# Altium project roverServoController.PrjPcb
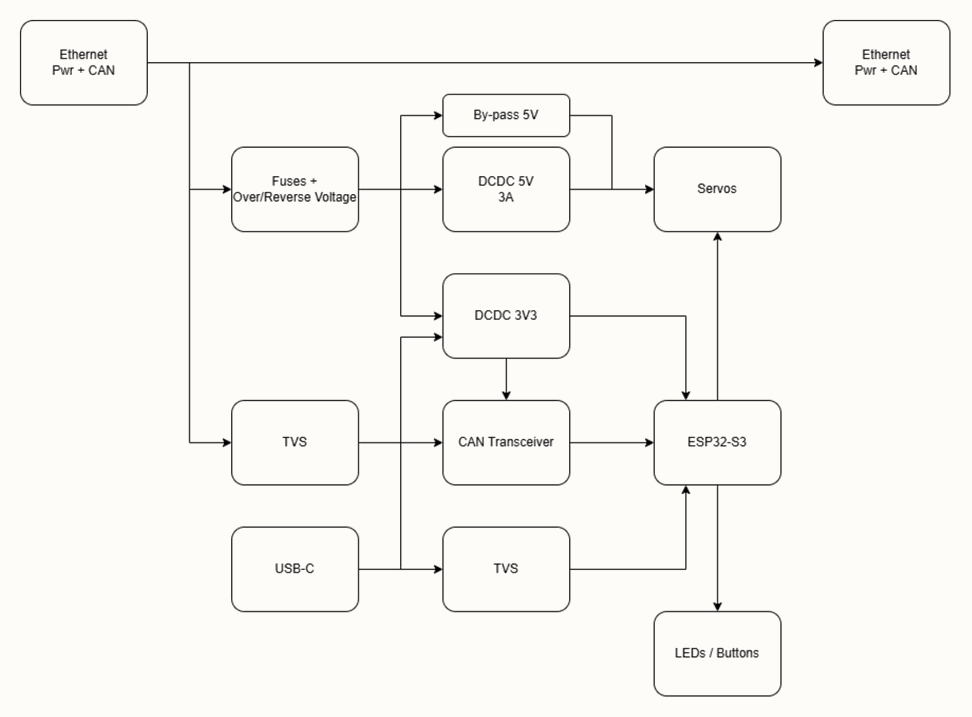
[diagram p0: Overview.SchDoc]
3 sheets, 72 parts. Net scope: flat (ports and power ports of the same name join across sheets).
Board file: roverServoController.PcbDoc
Sheets:
  Overview.SchDoc
  ESP32.SchDoc
  Power.SchDoc

## Sheet Overview.SchDoc
size A4; DrawnBy: Emile Renaud; Revision: V1.0; SheetNumber: 1; SheetTotal: 8

### Notes on the sheet
- Title:
- Date:
- Size:
- B
- Drawn by:
- Checked by:
- Sheet
- of
- Revision:
- File:

## Sheet ESP32.SchDoc
size A4; DrawnBy: Emile Renaud; Revision: V1.0; SheetNumber: 3; SheetTotal: 8
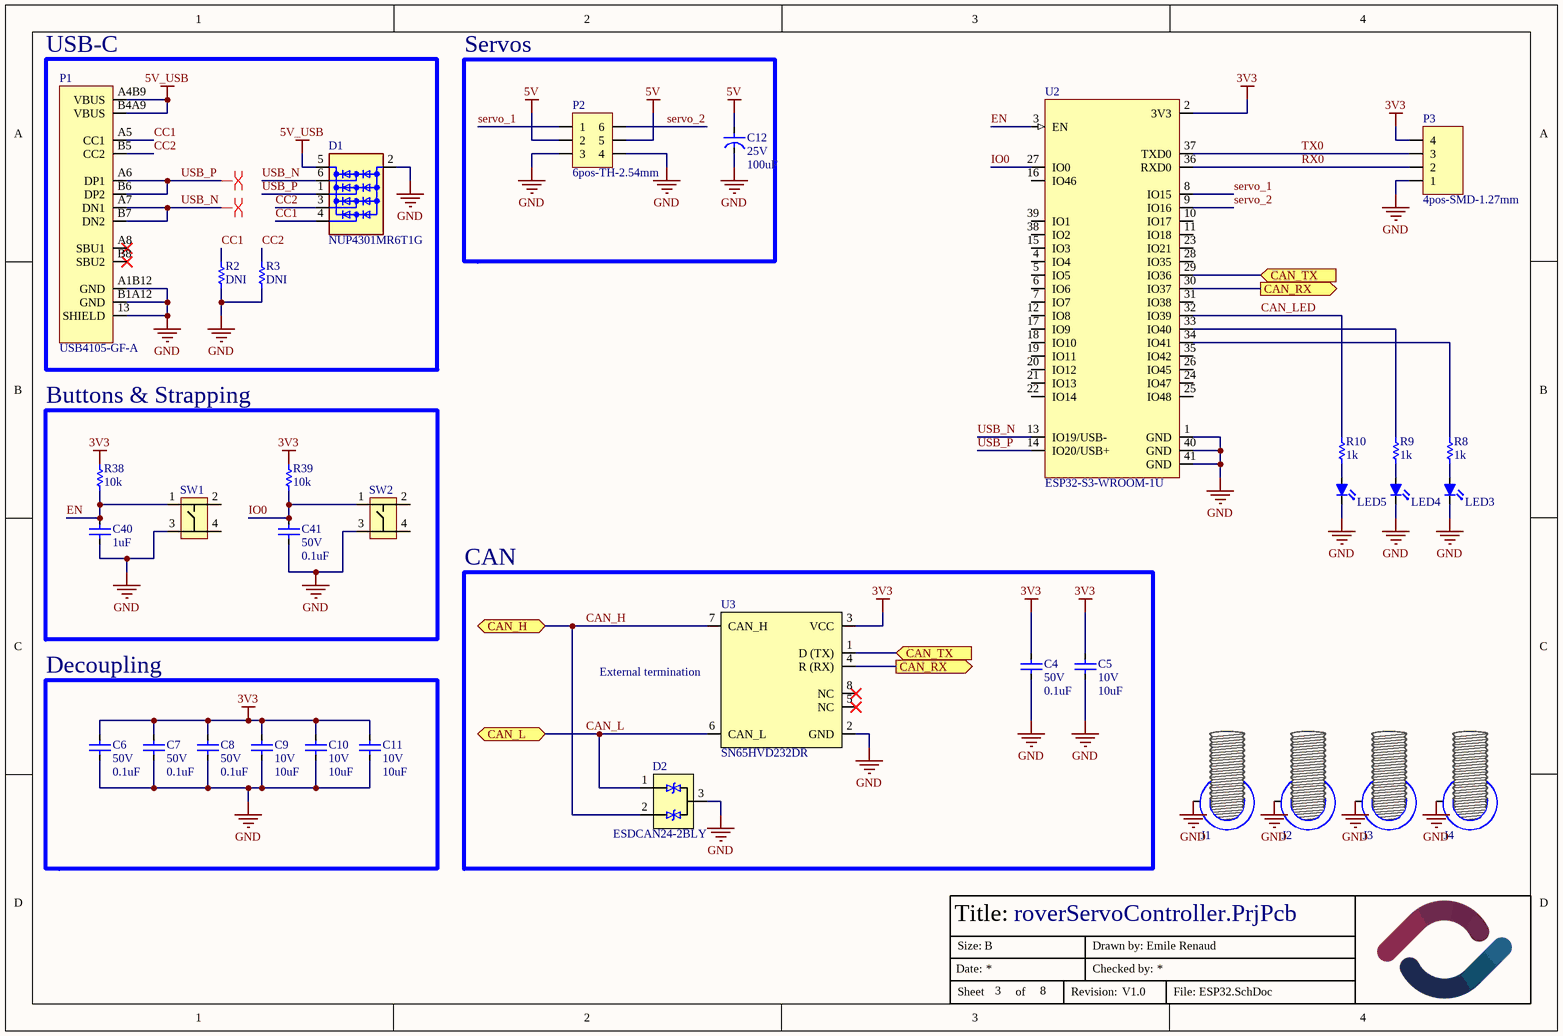
[diagram p1: ESP32.SchDoc]

### Parts
C4  value 0.1uF  Volt: 50V  [CAPACITOR-0603]  (hidden comment: Capacitor-0603-0.1uF-50V-X7R)
C5  value 10uF  Volt: 10V  [CAPACITOR-0603]  (hidden comment: Capacitor-0603-10uF-10V-X5R)
C6  value 0.1uF  Volt: 50V  [CAPACITOR-0603]  (hidden comment: Capacitor-0603-0.1uF-50V-X7R)
C7  value 0.1uF  Volt: 50V  [CAPACITOR-0603]  (hidden comment: Capacitor-0603-0.1uF-50V-X7R)
C8  value 0.1uF  Volt: 50V  [CAPACITOR-0603]  (hidden comment: Capacitor-0603-0.1uF-50V-X7R)
C9  value 10uF  Volt: 10V  [CAPACITOR-0603]  (hidden comment: Capacitor-0603-10uF-10V-X5R)
C10  value 10uF  Volt: 10V  [CAPACITOR-0603]  (hidden comment: Capacitor-0603-10uF-10V-X5R)
C11  value 10uF  Volt: 10V  [CAPACITOR-0603]  (hidden comment: Capacitor-0603-10uF-10V-X5R)
C12  value 100uF  Volt: 25V  [CAPACITOR-Aluminium-5x11mm-2mmPitch - SIDE]  (hidden comment: CAP ALUM 100UF 20% 25V RADIAL SIDE)
C40  value 1uF  [CAPACITOR-0603]  (hidden comment: Capacitor-0603-1uF-25V-X5R)
C41  value 0.1uF  Volt: 50V  [CAPACITOR-0603]  (hidden comment: Capacitor-0603-0.1uF-50V-X7R)
D1  NUP4301MR6T1G  [SOT-23-6]
D2  ESDCAN24-2BLY  [SOT-23-3]
J1  hole  [HOLE-3.40MM-M3-8MMEYELET]  (value not drawn)  (no BOM)
J2  hole  [HOLE-3.40MM-M3-8MMEYELET]  (value not drawn)  (no BOM)
J3  hole  [HOLE-3.40MM-M3-8MMEYELET]  (value not drawn)  (no BOM)
J4  hole  [HOLE-3.40MM-M3-8MMEYELET]  (value not drawn)  (no BOM)
LED3  3147-B1931NB--20C007614U1930CT-ND  [LED-0603-2PIN-SILKSCREEN]  (value not drawn)
LED4  3147-B1931NB--20C007614U1930CT-ND  [LED-0603-2PIN-SILKSCREEN]  (value not drawn)
LED5  3147-B1931NB--20C007614U1930CT-ND  [LED-0603-2PIN-SILKSCREEN]  (value not drawn)
P1  USB4105-GF-A  [USB-C]
P2  6pos-TH-2.54mm  [HDR2X3]
P3  4pos-SMD-1.27mm  [HDR1X4-SMD-50mils]
R2  value DNI  [RESISTOR-0603]  (hidden comment: Resistor-0603-5.1k)
R3  value DNI  [RESISTOR-0603]  (hidden comment: Resistor-0603-5.1k)
R8  value 1k  [Resistor-0603]  (hidden comment: SMT resistor)
R9  value 1k  [Resistor-0603]  (hidden comment: SMT resistor)
R10  value 1k  [Resistor-0603]  (hidden comment: SMT resistor)
R38  value 10k  [Resistor-0603]  (hidden comment: SMT resistor)
R39  value 10k  [Resistor-0603]  (hidden comment: SMT resistor)
SW1  PTS815 SJM 250 SMTR LFS  [SW4_PTS815 SJM 250 SMTR LFS_CNK]  (value not drawn)
SW2  PTS815 SJM 250 SMTR LFS  [SW4_PTS815 SJM 250 SMTR LFS_CNK]  (value not drawn)
U2  ESP32-S3-WROOM-1U  [ESP32-S3-WROOM-1U]
U3  SN65HVD232DR  [SOIC-8]

### Blocks framed on the sheet
USB-C: D1 P1 R2 R3
Servos: C12 P2
Buttons & Strapping: C40 C41 R38 R39 SW1 SW2
CAN: C4 C5 D2 U3
Decoupling: C6-C11

### Ports
CAN_H (bidir), CAN_L (bidir), CAN_RX (out), CAN_TX (in)

### Nets
3V3: C4.2 C5.2 C6.2 C7.2 C8.2 C9.2 C10.2 C11.2 P3.4 R38.2 R39.2 U2.2(3V3) U3.3(VCC)
5V: C12.1 P2.2 P2.5
5V_USB: D1.5(VDD) P1.A4B9(VBUS) P1.B4A9(VBUS)
GND: C4.1 C5.1 C6.1 C7.1 C8.1 C9.1 C10.1 C11.1 C12.2 C40.1 C41.1 D1.2(GND) D2.3(L3) J1.1 J2.1 J3.1 J4.1 LED3.1(K) LED4.1(K) LED5.1(K) P1.13(SHIELD) P1.A1B12(GND) P1.B1A12(GND) P2.3 P2.4 P3.1 R2.1 R3.1 SW1.3 SW2.3 U2.1(GND) U2.40(GND) U2.41(GND) U3.2(GND)
CAN_H: D2.2(GND) U3.7(CAN_H) ; port CAN_H
CAN_L: D2.1(L2) U3.6(CAN_L) ; port CAN_L
CAN_LED: R10.2 U2.32(IO39)
CAN_RX: U2.30(IO37) U3.4(R_(RX)) ; port CAN_RX
CAN_TX: U2.29(IO36) U3.1(D_(TX)) ; port CAN_TX
CC1: D1.4(L4) P1.A5(CC1) R2.2
CC2: D1.3(L3) P1.B5(CC2) R3.2
EN: C40.2 R38.1 SW1.1 U2.3(EN)
IO0: C41.2 R39.1 SW2.1 U2.27(IO0)
RX0: P3.2 U2.36(RXD0)
servo_1: P2.1 U2.8(IO15)
servo_2: P2.6 U2.9(IO16)
TX0: P3.3 U2.37(TXD0)
USB_N: D1.6(L1) P1.A7(DN1) P1.B7(DN2) U2.13(IO19/USB-)
USB_P: D1.1(L2) P1.A6(DP1) P1.B6(DP2) U2.14(IO20/USB+)
NetLED3_2: LED3.2(R) R8.1
NetLED4_2: LED4.2(R) R9.1
NetLED5_2: LED5.2(R) R10.1
NetR8_2: R8.2 U2.34(IO41)
NetR9_2: R9.2 U2.33(IO40)

Not connected (* = marked no-connect by the designer): P1 A8(SBU1)* B8(SBU2)*; SW1 2 4; SW2 2 4; U2 4(IO4) 5(IO5) 6(IO6) 7(IO7) 10(IO17) 11(IO18) 12(IO8) 15(IO3) 16(IO46) 17(IO9) 18(IO10) 19(IO11) 20(IO12) 21(IO13) 22(IO14) 23(IO21) 24(IO47) 25(IO48) 26(IO45) 28(IO35) 31(IO38) 35(IO42) 38(IO2) 39(IO1); U3 5(NC)* 8(NC)*

### Layout directives
differential pair; differential pair class USB: USB_N, USB_P

### Notes on the sheet
- (near U3) External termination
- Title:
- Date:
- Size:
- B
- Drawn by:
- Checked by:
- Sheet
- of
- Revision:
- File:

### Library data of the parts
C4 C6-C8 C41 = Capacitor-0603-0.1uF-50V-X7R: Precision: X7R-10%; Package / Case: Metric 1608, EIA 0603; Mounted: Yes; Supplier 1: Digi-Key; Supplier Part Number 1: 1276-1935-2-ND; Supplier 2: Digi-Key; Supplier Part Number 2: 1276-1934-2-ND
C5 C9-C11 = Capacitor-0603-10uF-10V-X5R: 10 µF ±20% 10V Ceramic Capacitor X5R 0603 (1608 Metric); Supplier 1: Digikey; Supplier Part Number 1: 4713-GMC10X5R106M10NTCT-ND; Mounted: Yes; Package / Case: Metric 1608 , EIA 0603; Precision: 20%
C12 = Capacitor-100uF-25V-Side: CAP ALUM 100UF 20% 25V RADIAL; Precision: 20%; Mounted: Yes; Supplier 1: Digi-Key; Supplier Part Number 1: 399-6102-ND; Supplier 2: Digi-Key
C40 = Capacitor-0603-1uF-25V-X5R: Precision: X5R-10%; Volt: 25V; Package / Case: Metric 1608, EIA 0603; Mounted: Yes; Supplier 1: Digi-Key; Supplier Part Number 1: 1276-1859-2-ND; Supplier 2: Digi-Key; Supplier Part Number 2: 1276-1942-2-ND
D1 = NUP4301MR6T1G: 4CH Clamp Ipp Tvs Diode Surface Mount SOT23-6 (SC74); Volt: 70; Supplier 1: Digi-Key; Supplier Part Number 1: NUP4301MR6T1GOSTR-ND; Mounted: Yes; Package / Case: SOT23-6
D2 = ESDCAN24-2BLY: 55V Clamp 6A (8/20µs) Ipp Tvs Diode Surface Mount SOT-23; Volt: 24; Supplier 1: Digi-Key; Supplier Part Number 1: 5272-ESDCAN24-2BLYCT-ND; Mounted: Yes; Package / Case: SOT-23-3
J1-J4 = Hole 3.40mm M3-Eyelet: Hole for M3 Bolt with 8mm pad; Mounted: N/A
LED3-LED5 = LED_BLUE: LED BLUE CLEAR 0603 SMD; Package / Case: 0603 (1608 Metric); Mounted: Yes; Supplier 1: Digi-Key; Supplier Part Number 1: 3147-B1931NB--20C007614U1930CT-ND
P1 = USB4105-GF-A: CONN RCP USB2.0 TYP C 24P SMD RA / 5A; Supplier 1: Digikey; Supplier Part Number 1: 2073-USB4105-GF-ACT-ND; Mounted: Yes; Package / Case: SMD; Volt: N/A
P2 = 6pos-TH-2.54mm 2x3: 6pos TH 2.54mm Header; Supplier 1: Digi-Key; Supplier Part Number 1: 952-2092-ND; Mounted: Yes; Package / Case: TH; Volt: N/A
P3 = 4pos-SMD-1.27mm: 4pos SMD 1.27mm; Supplier 1: Digi-Key; Supplier Part Number 1: N/A; Mounted: Yes; Package / Case: TH; Volt: N/A
R2 R3 = Resistor-0603-DNI: 0603 footprint DO NOT INSTALL; Mounted: Yes; Package/Case: Metric 1608 , EIA 0603
R8-R10 = Resistor-0603-1k: Resistor0603-1k; Precision: 1%; Watt: 0.1W; Mounted: Yes; Package / Case: Metric 1608, EIA 0603; Supplier 1: Digi-Key; Supplier Part Number 1: 311-1.00KHRCT-ND
R38 R39 = Resistor0603-10k: Precision: 1%; Watt: 0.1W; Mounted: Yes; Package / Case: Metric 1608, EIA 0603; Supplier 2: Digi-Key; Supplier 4: Digi-Key; Supplier Part Number 2: RMCF0603FT10K0TR-ND; Supplier 1: Digi-Key; Supplier 3: Digi-Key; Supplier Part Number 1: 311-10.0KHRTR-ND
SW1 SW2 = PTS815 SJM 250 SMTR LFS: TACT 4.2 X 3.2, 2.5 MM H, 180GF,; Volt: 12V; Current: 0.05A; Supplier 1: Digi-Key; Supplier Part Number 1: CKN12215-1-ND; Mounted: Yes
U2 = ESP32-S3-WROOM-1U: 2.4 GHz Wi-Fi (802.11 b/g/n) and Bluetooth 5 (LE) module; MF: Espressif Systems; Value: *; Package: Package; MP: ESP32-S3-WROOM-1U; Supplier 1: Digikey; Supplier Part Number 1: 1965-ESP32-S3-WROOM-1U-N8R8CT-ND
U3 = SN65HVD232DR: 1/1 Transceiver Half CANbus 8-SOIC; Package / Case: 8-SOIC; Mounted: Yes; Supplier 1: Digikey; Supplier Part Number 1: 296-26344-1-ND; HelpURL: https://www.ti.com/lit/ds/symlink/sn65hvd230.pdf?HQS=dis-dk-null-digikeymode-dsf-pf-null-wwe&ts=1723930967656&ref_url=https%253A%252F%252Fwww.ti.com%252Fgeneral%252Fdocs%252Fsuppproductinfo.tsp%253FdistId%253D10%2526gotoUrl%253Dhttps%253A%252F%252Fwww.ti.com%252Flit%252Fgpn%252Fsn65hvd230

## Sheet Power.SchDoc
size A4; DrawnBy: Emile Renaud; Revision: V1.0; SheetNumber: 2; SheetTotal: 8
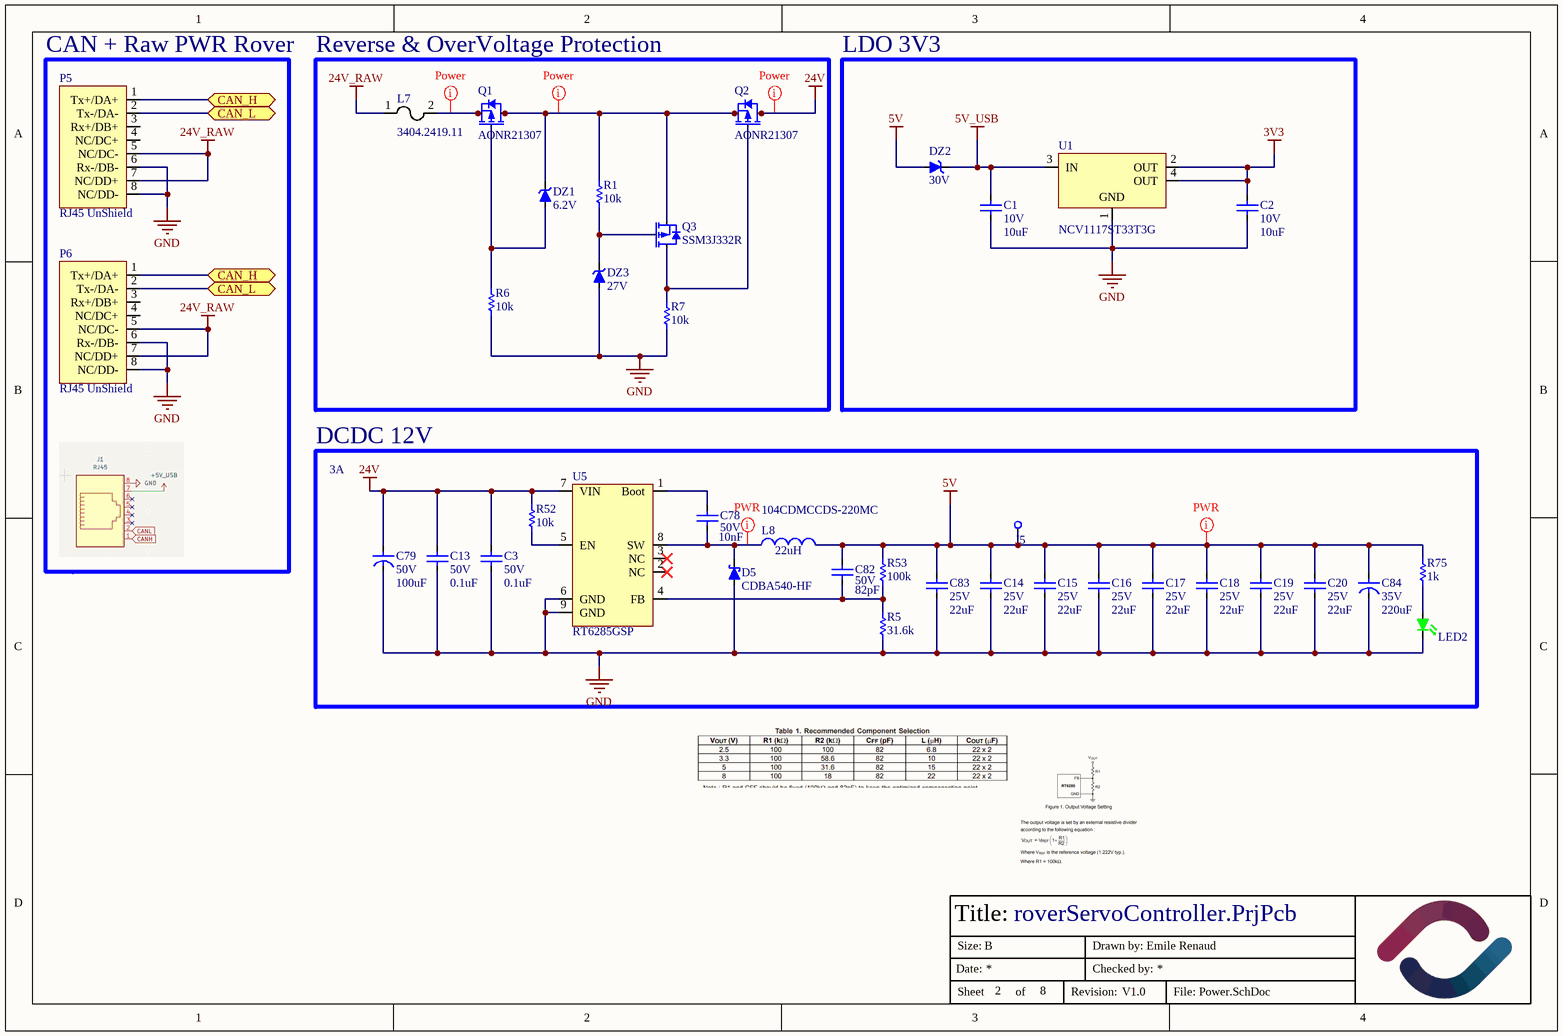
[diagram p2: Power.SchDoc]

### Parts
C1  value 10uF  Volt: 10V  [CAPACITOR-0603]  (hidden comment: Capacitor-0603-10uF-10V-X5R)
C2  value 10uF  Volt: 10V  [CAPACITOR-0603]  (hidden comment: Capacitor-0603-10uF-10V-X5R)
C3  value 0.1uF  Volt: 50V  [CAPACITOR-0603]  (hidden comment: Capacitor-0603-0.1uF-50V-X7R)
C13  value 0.1uF  Volt: 50V  [CAPACITOR-0603]  (hidden comment: Capacitor-0603-0.1uF-50V-X7R)
C14  value 22uF  Volt: 25V  [CAPACITOR-0805]  (hidden comment: Capacitor-0805-22uF-25V-X5R)
C15  value 22uF  Volt: 25V  [CAPACITOR-0805]  (hidden comment: Capacitor-0805-22uF-25V-X5R)
C16  value 22uF  Volt: 25V  [CAPACITOR-0805]  (hidden comment: Capacitor-0805-22uF-25V-X5R)
C17  value 22uF  Volt: 25V  [CAPACITOR-0805]  (hidden comment: Capacitor-0805-22uF-25V-X5R)
C18  value 22uF  Volt: 25V  [CAPACITOR-0805]  (hidden comment: Capacitor-0805-22uF-25V-X5R)
C19  value 22uF  Volt: 25V  [CAPACITOR-0805]  (hidden comment: Capacitor-0805-22uF-25V-X5R)
C20  value 22uF  Volt: 25V  [CAPACITOR-0805]  (hidden comment: Capacitor-0805-22uF-25V-X5R)
C78  value 10nF  Volt: 50V  [CAPACITOR-0603]  (hidden comment: Capacitor-0603-10nF-50V-X7R)
C79  value 100uF  Volt: 50V  [CAP_J-V_8X10P5_RUB]  (hidden comment: CAP ALUM 100UF 20% 25V SMD)
C82  value 82pF  Volt: 50V  [CAPACITOR-0603]  (hidden comment: Capacitor-0603-82pF-50V-C0G)
C83  value 22uF  Volt: 25V  [CAPACITOR-0805]  (hidden comment: Capacitor-0805-22uF-25V-X5R)
C84  value 220uF  Volt: 35V  [CAP_J-V_8X10P5_RUB]  (hidden comment: CAP ALUM 220UF 20% 35V SMD)
D5  CDBA540-HF  [SMA/DO-214AC]
DZ1  Volt: 6.2V  [SOD-123]  (hidden comment: BZT52C6V2-TP)
DZ2  Volt: 30V  [DO-219AD]  (hidden comment: MSS1P3L-M3/89A)
DZ3  Volt: 27V  [SOD-123F]  (hidden comment: MMSZ5254B-TP)
J5  hole  [HOLE-0.53MM]  (value not drawn)  (no BOM)
L7  3404.2419.11  [2-SMD-Fuse]
L8  104CDMCCDS-220MC  value 22uH  [Inductor_22UH 5A]
LED2  3147-B1911NG--20D000214U1930CT-ND  [LED-0603-2PIN-SILKSCREEN]  (value not drawn)
P5  RJ45 UnShield  [AMPHENOL_54602-908LF]
P6  RJ45 UnShield  [AMPHENOL_54602-908LF]
Q1  AONR21307  [DFN8_3x3_Power]
Q2  AONR21307  [DFN8_3x3_Power]
Q3  SSM3J332R  [SOT-23-3]
R1  value 10k  [Resistor-0603]  (hidden comment: SMT resistor)
R5  value 31.6k  [Resistor-0603]  (hidden comment: SMT resistor)
R6  value 10k  [Resistor-0603]  (hidden comment: SMT resistor)
R7  value 10k  [Resistor-0603]  (hidden comment: SMT resistor)
R52  value 10k  [Resistor-0603]  (hidden comment: SMT resistor)
R53  value 100k  [Resistor-0603]  (hidden comment: SMT resistor)
R75  value 1k  [Resistor-0603]  (hidden comment: SMT resistor)
U1  NCV1117ST33T3G  [SOT-223-3/TO-261-3S]
U5  RT6285GSP  [SOIC-8-EXPOSED-PAD]

### Blocks framed on the sheet
CAN + Raw PWR Rover: P5 P6
Reverse & OverVoltage Protection: DZ1 DZ3 L7 Q1-Q3 R1 R6 R7
LDO 3V3: C1 C2 DZ2 U1
DCDC 12V: C3 C13-C20 C78 C79 C82-C84 D5 J5 L8 LED2 R5 R52 R53 R75 U5

### Ports
CAN_H (bidir), CAN_L (bidir)

### Nets
3V3: C2.2 U1.2(OUT) U1.4(OUT)
5V: C14.2 C15.2 C16.2 C17.2 C18.2 C19.2 C20.2 C82.2 C83.2 C84.1 DZ2.2(A) J5.1 L8.2 R53.2 R75.2
5V_USB: C1.2 DZ2.1(K) U1.3(IN)
24V: C3.2 C13.2 C79.1 Q2.5(D) Q2.6(D) Q2.7(D) Q2.8(D) R52.2 U5.7(VIN)
24V_RAW: L7.1 P5.5(NC/DC-) P5.7(NC/DD+) P6.5(NC/DC-) P6.7(NC/DD+)
GND: C1.1 C2.1 C3.1 C13.1 C14.1 C15.1 C16.1 C17.1 C18.1 C19.1 C20.1 C79.2 C83.1 C84.2 D5.1(A) DZ3.1(A) LED2.1(K) P5.6(Rx-/DB-) P5.8(NC/DD-) P6.6(Rx-/DB-) P6.8(NC/DD-) R5.1 R6.1 R7.1 U1.1(GND) U5.6(GND) U5.9(GND)
CAN_H: P5.1(Tx+/DA+) P6.1(Tx+/DA+) ; port CAN_H
CAN_L: P5.2(Tx-/DA-) P6.2(Tx-/DA-) ; port CAN_L
NetC78_1: C78.1 D5.2(K) L8.1 U5.8(SW)
NetC78_2: C78.2 U5.1(Boot)
NetC82_1: C82.1 R5.2 R53.1 U5.4(FB)
NetDZ1_1: DZ1.1(A) Q1.4(G) R6.2
NetDZ1_2: DZ1.2(K) Q1.5(D) Q1.6(D) Q1.7(D) Q1.8(D) Q2.1(S) Q2.2(S) Q2.3(S) Q3.2(S) R1.2
NetDZ3_2: DZ3.2(K) Q3.1(G) R1.1
NetL7_2: L7.2 Q1.1(S) Q1.2(S) Q1.3(S)
NetLED2_2: LED2.2(R) R75.1
NetQ2_4: Q2.4(G) Q3.3(D) R7.2
NetR52_1: R52.1 U5.5(EN)

Not connected (* = marked no-connect by the designer): P5 3(Rx+/DB+) 4(NC/DC+); P6 3(Rx+/DB+) 4(NC/DC+); U5 2(NC)* 3(NC)*

### Layout directives
net class Power: 5V, 24V, NetC78_1, NetDZ1_2, NetL7_2

### Notes on the sheet
- 3A
- Title:
- Date:
- Size:
- B
- Drawn by:
- Checked by:
- Sheet
- of
- Revision:
- File:

### Library data of the parts
C1 C2 = Capacitor-0603-10uF-10V-X5R: as C5 on sheet ESP32; Supplier 1: Digikey; Supplier Part Number 1: 4713-GMC10X5R106M10NTCT-ND; Mounted: Yes; Package / Case: Metric 1608 , EIA 0603; Precision: 20%
C3 C13 = Capacitor-0603-0.1uF-50V-X7R: Precision: X7R-10%; Package / Case: Metric 1608, EIA 0603; Mounted: Yes; Supplier 1: Digi-Key; Supplier Part Number 1: 1276-1935-2-ND; Supplier 2: Digi-Key; Supplier Part Number 2: 1276-1934-2-ND
C14-C20 C83 = Capacitor-0805-22uF-25V-X5R: Precision: X5R-20%; Package / Case: Metric 2012 , EIA 0805; Mounted: Yes; Supplier 1: Digi-Key; Supplier Part Number 1: 490-12389-1-ND; Supplier 2: Digi-Key
C78 = Capacitor-0603-10nF-50V-X7R: Precision: X7R-10%; Mounted: Yes; Package / Case: Metric 1608 , EIA 0603; Supplier 1: Digikey; Supplier Part Number 1: 490-4778-1-ND
C79 = Capacitor-100uF-50V-SMD: CAP ALUM 100UF 20% 50V SMD; Precision: 20%; Mounted: Yes; Supplier 1: Digi-Key; Supplier Part Number 1: 1189-1651-1-ND; Supplier 2: Digi-Key
C82 = Capacitor-0603-82pF-50V-C0G: Precision: C0G-5%; Package / Case: Metric 1608, EIA 0603; Mounted: Yes; Supplier 1: Digi-Key; Supplier Part Number 1: 478-KGM15ACG1H820JTCT-ND; Supplier 2: Digi-Key
C84 = Capacitor-220uF-35V-SMD: Precision: 20%; Mounted: Yes; Supplier 1: Digi-Key; Supplier Part Number 1: 1189-1651-1-ND; Supplier 2: Digi-Key
D5 = CDBA540-HF: DIODE SCHOTTKY 40V 5A SMA; Supplier 1: Digi-Key; Supplier Part Number 1: 641-1707-1-ND; Mounted: Yes; Package / Case: SMA; Volt: 40V
DZ1 = BZT52C6V2-TP: Zener Diode 6.2 V 200 mW ±6% Surface Mount SOD-123; Watt: 200mW; Grade: None; Package / Case: SOD-123; Supplier 1: Digi-Key; Supplier Part Number 1: BZT52C13-TPMSCT-ND; Mounted: Yes; Precision: 6%
DZ2 = MSS1P3L-M3/89A: Diode 30 V 1A Surface Mount MicroSMP (DO-219AD); Grade: None; Package / Case: DO-214AC, SMA; Supplier 1: Digi-Key; Supplier Part Number 1: MSS1P3L-M3/89AGICT-ND; Mounted: Yes
DZ3 = MMSZ5254B-TP: DIODE ZENER 27V 500MW SOD123; Watt: 0.5W; Precision: 5%; Grade: None; Package / Case: SOD-123; Supplier 1: Digi-Key; Supplier Part Number 1: MMSZ5254B-TPMSCT-ND; Mounted: Yes
J5 = Hole 0.53mm AWG28-Solid: Hole for 28 AWG Solid Wire; Mounted: N/A
L7 = 3404.2419.11: 2 A 277 V AC 250 V DC Fuse Board Mount (Cartridge Style Excluded) Requires Holder, Surface Mount 2-SMD, Square End Block with Clip; Current: 2A; Supplier 1: Digi-Key; Mounted: Yes; Supplier Part Number 1: 486-2091-ND; Package / Case: SMD
L8 = 104CDMCCDS-220MC: FIXED IND 22UH 5A 66 MOHM SMD; Precision: 20%; Supplier 1: Digi-Key; Mounted: Yes; Supplier Part Number 1: 308-2498-1-ND; Package / Case: SMD; Current: 5A
LED2 = LED_GREEN: LED GREEN DIFFUSED 0603 SMD; Package / Case: 0603 (1608 Metric); Mounted: Yes; Supplier 1: Digi-Key; Supplier Part Number 1: 3147-B1911NG--20D000214U1930CT-ND
P5 P6 = RJ545: Jack Modular Connector 8p8c (RJ45, Ethernet) 90° Angle (Right) Unshielded Cat3; Supplier 1: Digikey; Supplier Part Number 1: 609-1046-ND; Mounted: Yes; Package / Case: SMD; Volt: N/A; HelpURL: https://cdn.amphenol-cs.com/media/wysiwyg/files/drawing/c-bmj-0102.pdf
Q1 Q2 = AONR21307: MOSFET P-CH 30V 24A 8DFN; Supplier 1: Digi-Key; Supplier Part Number 1: 785-1796-2-ND; Volt: 30V; Package / Case: 8-DFN-EP (3x3); Mounted: Yes; Current: 24A
Q3 = SSM3J332R: P-Channel 30 V 6A (Ta) 1W (Ta) Surface Mount SOT-23F; Volt: 30V; Supplier 1: Digi-Key; Supplier Part Number 1: SSM3J332RLFCT-ND; Package / Case: SOT-523; Mounted: Yes; Current: 6A
R1 R6 R7 = Resistor0603-10k: Precision: 1%; Watt: 0.1W; Mounted: Yes; Package / Case: Metric 1608, EIA 0603; Supplier 2: Digi-Key; Supplier 4: Digi-Key; Supplier Part Number 2: RMCF0603FT10K0TR-ND; Supplier 1: Digi-Key; Supplier 3: Digi-Key; Supplier Part Number 1: 311-10.0KHRTR-ND
R5 = Resistor-0603-31.6k: Resistor0603-31.6k; Precision: 1%; Watt: 0.1W; Mounted: Yes; Package / Case: Metric 1608, EIA 0603; Supplier 1: Digi-Key; Supplier Part Number 1: 311-31.6KHRCT-ND
R52 = Resistor-0603-10k: Resistor0603-10k; Precision: 1%; Watt: 0.1W; Mounted: Yes; Package / Case: Metric 1608, EIA 0603; Supplier 1: Digi-Key; Supplier Part Number 1: 311-10.0KHRTR-ND
R53 = Resistor-0603-100k: Resistor0603-100k; Precision: 1%; Watt: 0.1W; Mounted: Yes; Package / Case: Metric 1608, EIA 0603; Supplier 1: Digi-Key; Supplier Part Number 1: 311-100KHRCT-ND
R75 = Resistor-0603-1k: as R8 on sheet ESP32; Mounted: Yes; Package / Case: Metric 1608, EIA 0603; Supplier 1: Digi-Key; Supplier Part Number 1: 311-1.00KHRCT-ND
U1 = NCV1117ST33T3G: IC REG LINEAR 3.3V 1A SOT223; Supplier 1: Digi-Key; Supplier Part Number 1: NCP1117ST15T3GOSTR-ND; Package / Case: SOT223; Mounted: Yes
U5 = RT6285GSP: 5A Buck Switching Regulator IC Positive Adjustable 1.222V 1 Output 5A 8-SOIC (0.154", 3.90mm Width) Exposed Pad; Grade: None; Supplier 1: Digi-Key; Supplier Part Number 1: 1028-RT6285GSPCT-ND; HelpURL: file:///C:/Users/Emile/Downloads/DS6285-00.pdf; Package / Case: 8-SOIC-EP; Mounted: Yes

## Nets that join several sheets
3V3: ESP32 (13 pins), Power (C2.2 U1.2 U1.4)
5V: ESP32 (C12.1 P2.2 P2.5), Power (15 pins)
5V_USB: ESP32 (D1.5 P1.A4B9 P1.B4A9), Power (C1.2 DZ2.1 U1.3)
GND: ESP32 (34 pins), Power (27 pins)
CAN_H: ESP32 (D2.2 U3.7), Power (P5.1 P6.1)
CAN_L: ESP32 (D2.1 U3.6), Power (P5.2 P6.2)